# EAGLE design u-nex_ICSP_SHIELD (EAGLE 6.5.0)
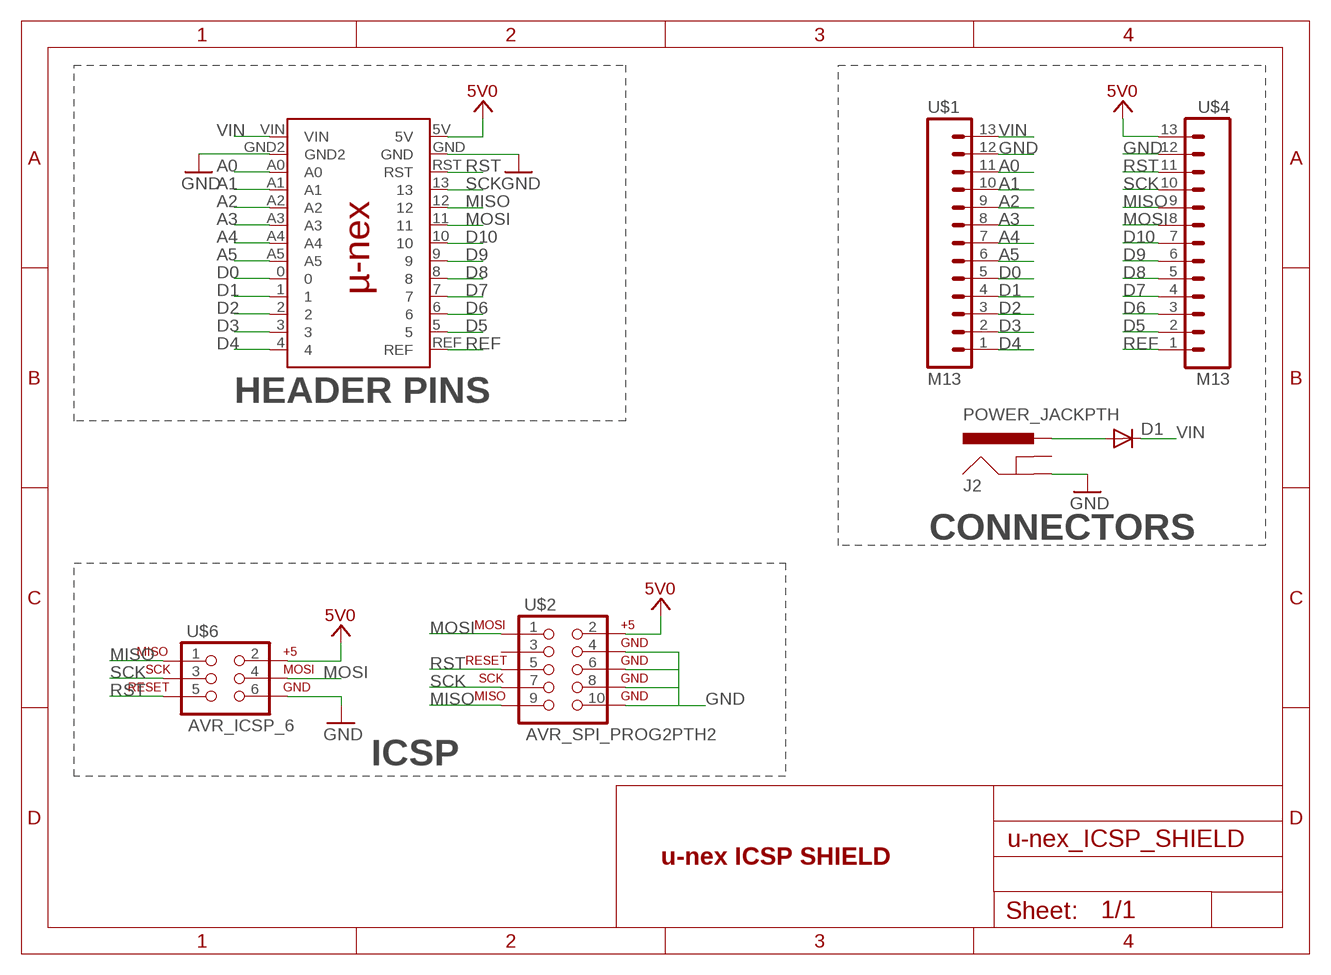
[diagram p0: schematic, sheet 1]

## Parts
D1  DIODEPTH  [DIODE-1N4001]
J2  POWER_JACKPTH  [POWER_JACK_PTH]
U$1  M13  [1X13]
U$2  AVR_SPI_PROG2PTH2  [2X5-SHROUDED]
U$4  M13  [1X13]
U$6  AVR_ICSP_6  [2X3_SHROUDED]
U$10  U-NEX  [U-NEX]

## Nets
5V0: U$2.2 U$4.13 U$6.2 U$10.5V
A0: U$1.11 U$10.A0
A1: U$1.10 U$10.A1
A2: U$1.9 U$10.A2
A3: U$1.8 U$10.A3
A4: U$1.7 U$10.A4
A5: U$1.6 U$10.A5
D0: U$1.5 U$10.0
D1: U$1.4 U$10.1
D2: U$1.3 U$10.2
D3: U$1.2 U$10.3
D4: U$1.1 U$10.4
D5: U$4.2 U$10.5
D6: U$4.3 U$10.6
D7: U$4.4 U$10.7
D8: U$4.5 U$10.8
D9: U$4.6 U$10.9
D10: U$4.7 U$10.10
GND: J2.GND U$1.12 U$2.4 U$2.6 U$2.8 U$2.10 U$4.12 U$6.6 U$10.GND U$10.GND2
MISO: U$2.9 U$4.9 U$6.1 U$10.12
MOSI: U$2.1 U$4.8 U$6.4 U$10.11
N$1: D1.A J2.PWR
REF: U$4.1 U$10.REF
RST: U$2.5 U$4.11 U$6.5 U$10.RST
SCK: U$2.7 U$4.10 U$6.3 U$10.13
VIN: D1.C U$1.13 U$10.VIN
Unconnected: J2.GNDBREAK U$2.3

## Notes on the sheet
- HEADER PINS
- CONNECTORS
- ICSP
- u-nex ICSP SHIELD

## Library data of the parts
D1 = SparkFun-DiscreteSemi:DIODE: Diode These are standard reverse protection diodes and small signal diodes. SMA package can handle up to about 1A. SOD-323 can handle about 200mA. What the SOD-323 package when ordering, there are some mfgs out there that are 5-pin packages.
J2 = SparkFun-Connectors:POWER_JACK: Power Jack This is the standard 5.5mm barrel jack for power. The PTH is the most common, proven, reliable, footprint. The Slot footprint only works if the mill layer is transmitted to the PCB fab house so be warned. Spark Fun Electronics SKU : PRT-00119 SMT: CONN-08106 Mating wall wart : TOL-00298 (and others)
U$1 U$4 = Frenoy_custom_GOA:M13
U$2 = SparkFun-Connectors:AVR_SPI_PROG2: AVR 10-pin ICSP Header This is the standard AVR In Circuit Serial Programming header. Minimal, but includes pin one indicator. Works with standard Olimex programmers. Also look for the 6-pin reduced version. Spark Fun Electronics SKU: PRT-00778
U$6 = Frenoy_Custom:AVR_ICSP_6
U$10 = Frenoy_Custom:U-NEX

## Board
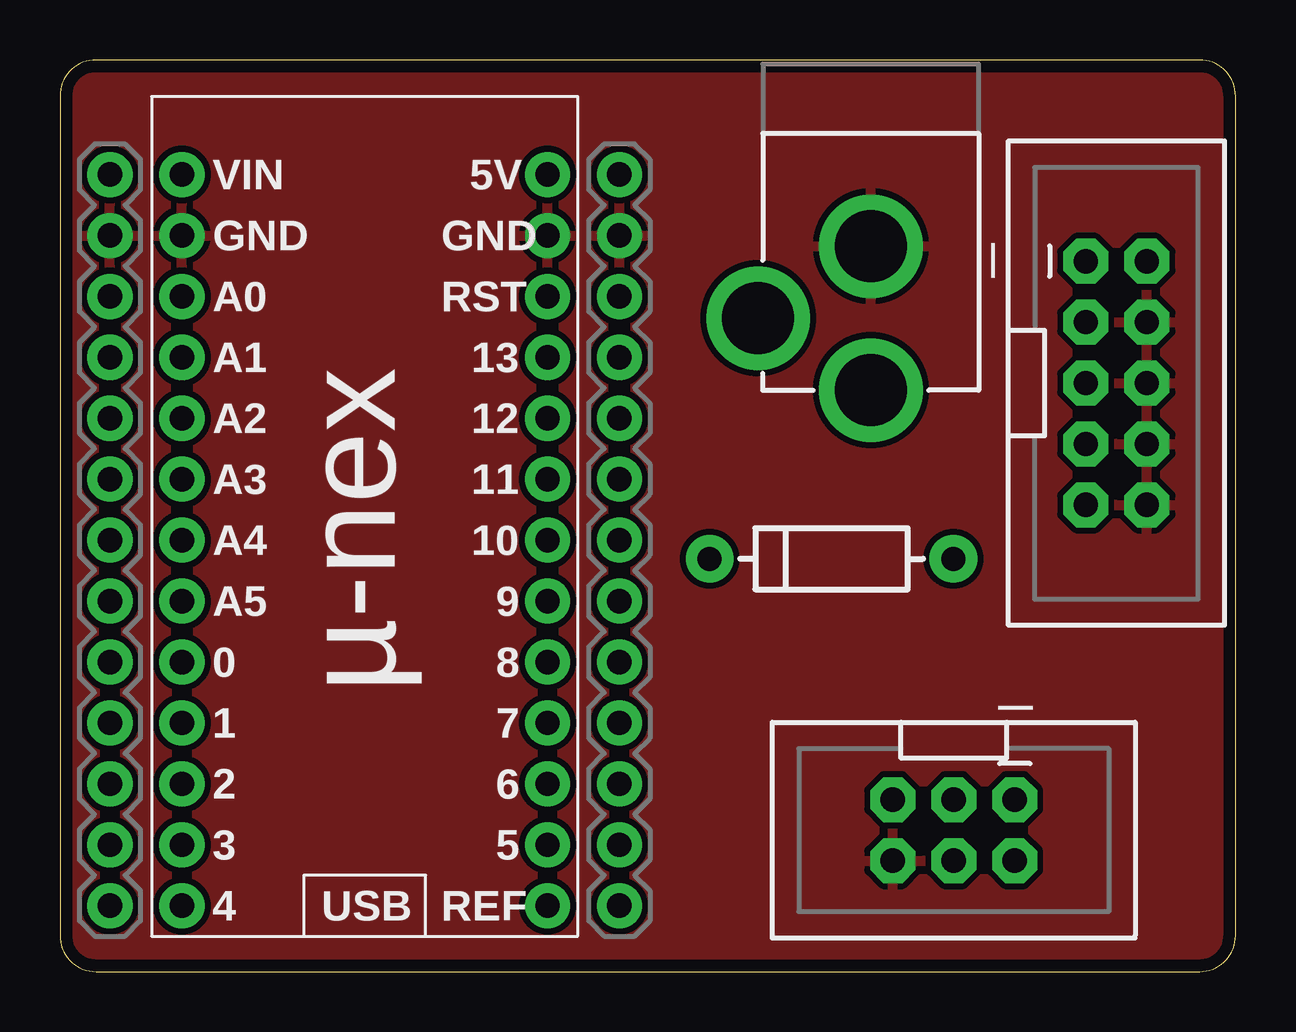
[diagram p1: board, top side]
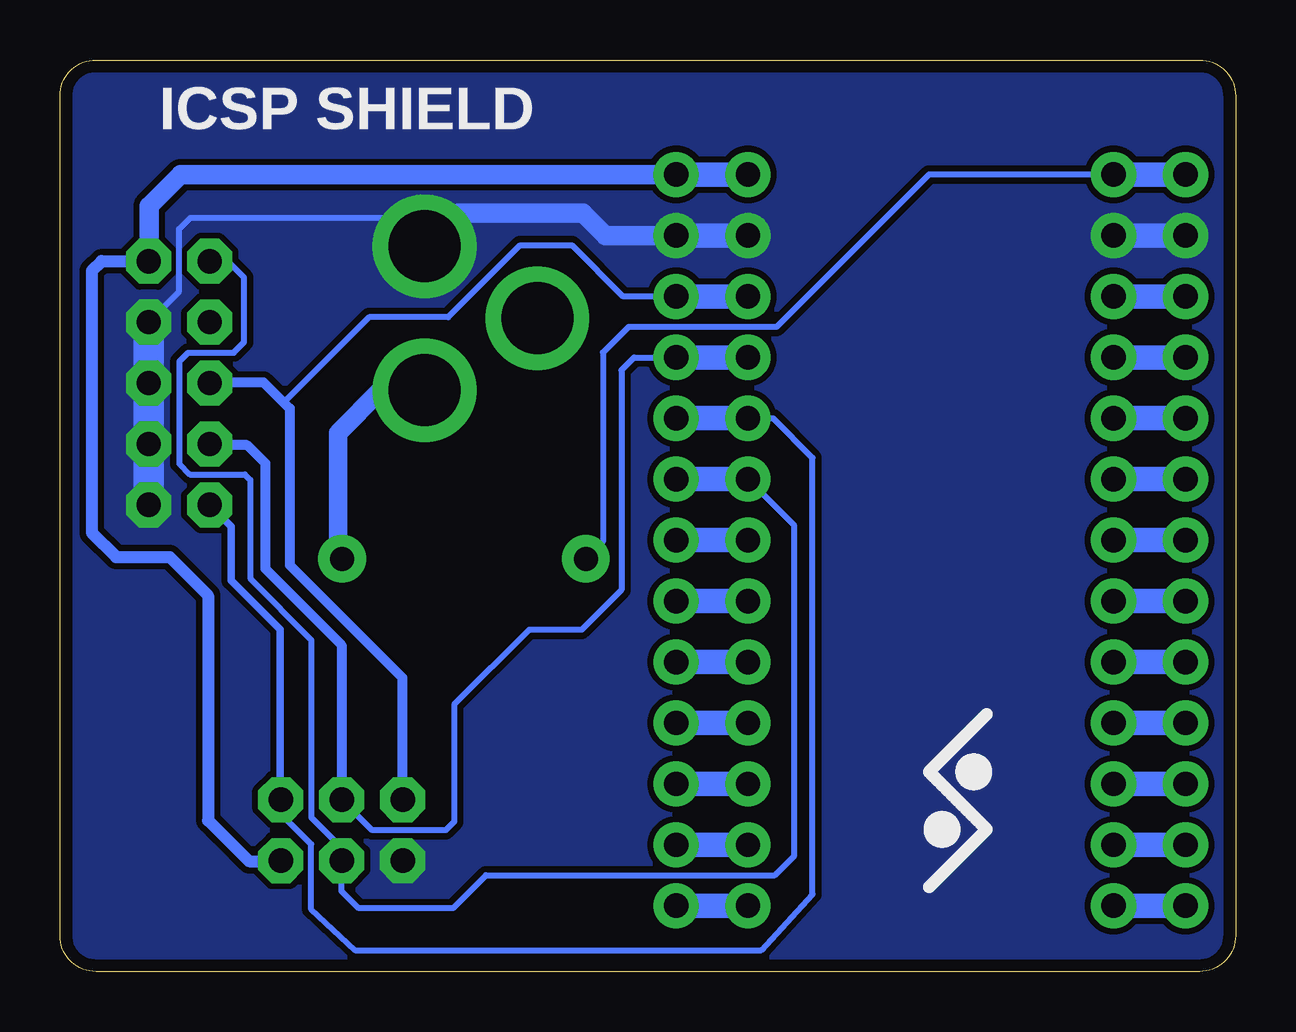
[diagram p2: board, bottom side, seen from below]

Size 49 x 38 mm. Coordinates in mm from the lower left corner, seen from the top.
Outline: 49,1.5 49,36.5 arc90 47.5,38 1.5,38 arc90 0,36.5 0,1.5 arc90 1.5,0 47.5,0 arc90 49,1.5
Copper layers 1*16: Top 0.035mm / dielectric 1.5mm / Bottom 0.035mm
Design rules "default": minimum track width 9.5mil, minimum drill 24mil, track to track 8mil, track to pad 8mil, pad to pad 8mil, via to via 8mil, smd to smd 8mil, copper to edge 20mil, drill to drill 8mil, minimum pad ring 10mil, minimum via ring 8mil, stop-mask expansion 4mil, vias tented up to drill 0mil, thermal gap 10mil

### Footprints (pad centres in the part's own frame; a part is rotated, then mirrored left to right if it is on the bottom)
DIODE-1N4001 = drill 1 pad 1.981: A -5.08,0; C 5.08,0
POWER_JACK_PTH = drill 2.997 pad 4.318: GND 0,7.7; GNDBREAK 4.7,10.7; PWR 0,13.7
1X13 = drill 1.016 pad 1.88: 1 0,0; 2 2.54,0; 3 5.08,0; 4 7.62,0; 5 10.16,0; 6 12.7,0; 7 15.24,0; 8 17.78,0; 9 20.32,0; 10 22.86,0; 11 25.4,0; 12 27.94,0; 13 30.48,0
2X5-SHROUDED = drill 1.016 pad 1.88 octagon: 1 -1.27,5.08; 2 1.27,5.08; 3 -1.27,2.54; 4 1.27,2.54; 5 -1.27,0; 6 1.27,0; 7 -1.27,-2.54; 8 1.27,-2.54; 9 -1.27,-5.08; 10 1.27,-5.08
2X3_SHROUDED = drill 1.016 pad 1.88 octagon: 1 -1.27,2.54; 2 1.27,2.54; 3 -1.27,0; 4 1.27,0; 5 -1.27,-2.54; 6 1.27,-2.54
U-NEX = drill 1.016 pad 1.88: 0 1.27,11.43; 1 1.27,8.89; 2 1.27,6.35; 3 1.27,3.81; 4 1.27,1.27; 5 16.51,3.81; 5V 16.51,31.75; 6 16.51,6.35; 7 16.51,8.89; 8 16.51,11.43; 9 16.51,13.97; 10 16.51,16.51; 11 16.51,19.05; 12 16.51,21.59; 13 16.51,24.13; A0 1.27,26.67; A1 1.27,24.13; A2 1.27,21.59; A3 1.27,19.05; A4 1.27,16.51; A5 1.27,13.97; GND 16.51,29.21; GND2 1.27,29.21; REF 16.51,1.27; RST 16.51,26.67; VIN 1.27,31.75

### Placement (x,y rotation side)
D1  32.16,17.21 180 top
J2  33.8,37.94 180 top
U$1  2.08,2.74 90 top
U$2  44.03,24.53 0 top
U$4  23.32,2.74 90 top
U$6  37.26,5.89 270 top
U$10  3.81,1.47 0 top

### Tracks (layer width: path | path; a pad name or v marks a point on that pad's centre or on a via)
5V0
  Bottom 0.508: U$2.2 47.27,29.62 47.68,29.21 47.68,18.29 46.66,17.27 44.42,17.27 42.82,15.67 42.82,6.3 41.12,4.6 39.82,4.6 U$6.2
  Bottom 0.813: U$2.2 45.29,29.62 45.29,31.9 43.97,33.22 U$4.13
  Bottom 1.016: U$10.5V U$4.13
A0
  Bottom 1.016: U$1.11 U$10.A0
A1
  Bottom 1.016: U$1.10 U$10.A1
A2
  Bottom 1.016: U$1.9 U$10.A2
A3
  Bottom 1.016: U$1.8 U$10.A3
A4
  Bottom 1.016: U$1.7 U$10.A4
A5
  Bottom 1.016: U$1.6 U$10.A5
D0
  Bottom 1.016: U$1.5 U$10.0
D1
  Bottom 1.016: U$1.4 U$10.1
D2
  Bottom 1.016: U$1.3 U$10.2
D3
  Bottom 1.016: U$1.2 U$10.3
D4
  Bottom 1.016: U$1.1 U$10.4
D5
  Bottom 1.016: U$10.5 U$4.2
D6
  Bottom 1.016: U$10.6 U$4.3
D7
  Bottom 1.016: U$10.7 U$4.4
D8
  Bottom 1.016: U$10.8 U$4.5
D9
  Bottom 1.016: U$4.6 U$10.9
D10
  Bottom 1.016: U$10.10 U$4.7
GND
  Bottom 0.254: U$2.4 44.03,28.35 44.03,30.95 43.56,31.42 34.98,31.42 J2.GND
  Bottom 0.813: U$4.12 26.26,30.68 27.2,31.62 32.41,31.62 J2.GND
  Bottom 1.016: U$1.12 U$10.GND2 | U$10.GND U$4.12
  Bottom 1.27: U$2.4 U$2.6 U$2.8 U$2.10
  pour Bottom (isolate 0.254, no thermals): 0,38.1 49.23,38.1 49.15,0 0,0
  pour Top (isolate 0.254): 0,38 49,38 49,0 0,0
MISO
  Bottom 0.254: U$10.12 19.28,23.06 17.63,21.41 17.63,3.23 19.76,0.89 36.7,0.89 38.53,2.59 38.53,5.3 39.8,6.58 U$6.1
  Bottom 0.305: U$6.1 39.83,7.19 39.83,14.27 41.86,16.31 41.86,18.55 U$2.9
  Bottom 1.016: U$4.9 U$10.12
MOSI
  Bottom 0.254: 20.3,20.55 U$10.11 18.39,18.59 18.39,4.83 19.2,4.01 31.24,4.01 32.61,2.64 36.55,2.64 37.26,3.35 U$6.4 37.26,5.16 38.52,6.42 38.52,13.82 41.07,16.39 41.07,20.5 41.3,20.72 43.59,20.72 44.03,21.17 44.03,25.43 43.66,25.8 41.76,25.8 41.33,26.23 41.33,28.93 42.01,29.62 U$2.1
  Bottom 1.016: U$10.11 U$4.8
N$1
  Bottom 0.762: J2.PWR 35.63,24.24 37.41,22.45 37.41,17.38 D1.A
REF
  Bottom 1.016: U$10.REF U$4.1
RST
  Bottom 0.254: U$4.11 25.53,28.14 27.66,30.28 29.82,30.28 32.82,27.28 36.12,27.28 39.67,23.72 | U$2.5 42.73,24.56 | U$6.5
  Bottom 0.406: 42.73,24.56 40.51,24.56 39.67,23.72 39.42,23.47 39.42,16.94 34.72,12.24 U$6.5
  Bottom 1.016: U$10.RST U$4.11
SCK
  Bottom 0.254: U$4.10 25.07,25.6 25.6,25.07 25.6,15.9 27.25,14.25 29.44,14.25 32.56,11.12 32.56,6.25 32.92,5.89 35.99,5.89 U$6.3 | 42.72,21.95 U$2.7
  Bottom 0.406: 42.72,21.95 41.2,21.95 40.44,21.18 40.44,16.79 37.26,13.61 U$6.3
  Bottom 1.016: U$10.13 U$4.10
VIN
  Bottom 0.254: U$10.VIN 12.78,33.22 19.13,26.87 25.3,26.87 26.36,25.81 26.36,17.92 D1.C
  Bottom 1.016: U$1.13 U$10.VIN

### Text on the board
tPlace: _ | _
bPlace: ICSP SHIELD